# Altium schematic sheet Drive.SchDoc
size A3; PageSetup: Record=PageOptions|CenterHorizontal=True|CenterVertical=True|PrintScale=1.00|XCorrection=1.00|YCorrection=1.00|PrintKind=0|BorderSize=5000000|LeftOffset=0|BottomOffset=0|Orientation=2|PaperLength=1000|PaperWidth=1000|Scale=100|PaperSource=7|PrintQuality=-4|MediaType=1|DitherType=10|PaperKind=A3|PrintScaleMode=1
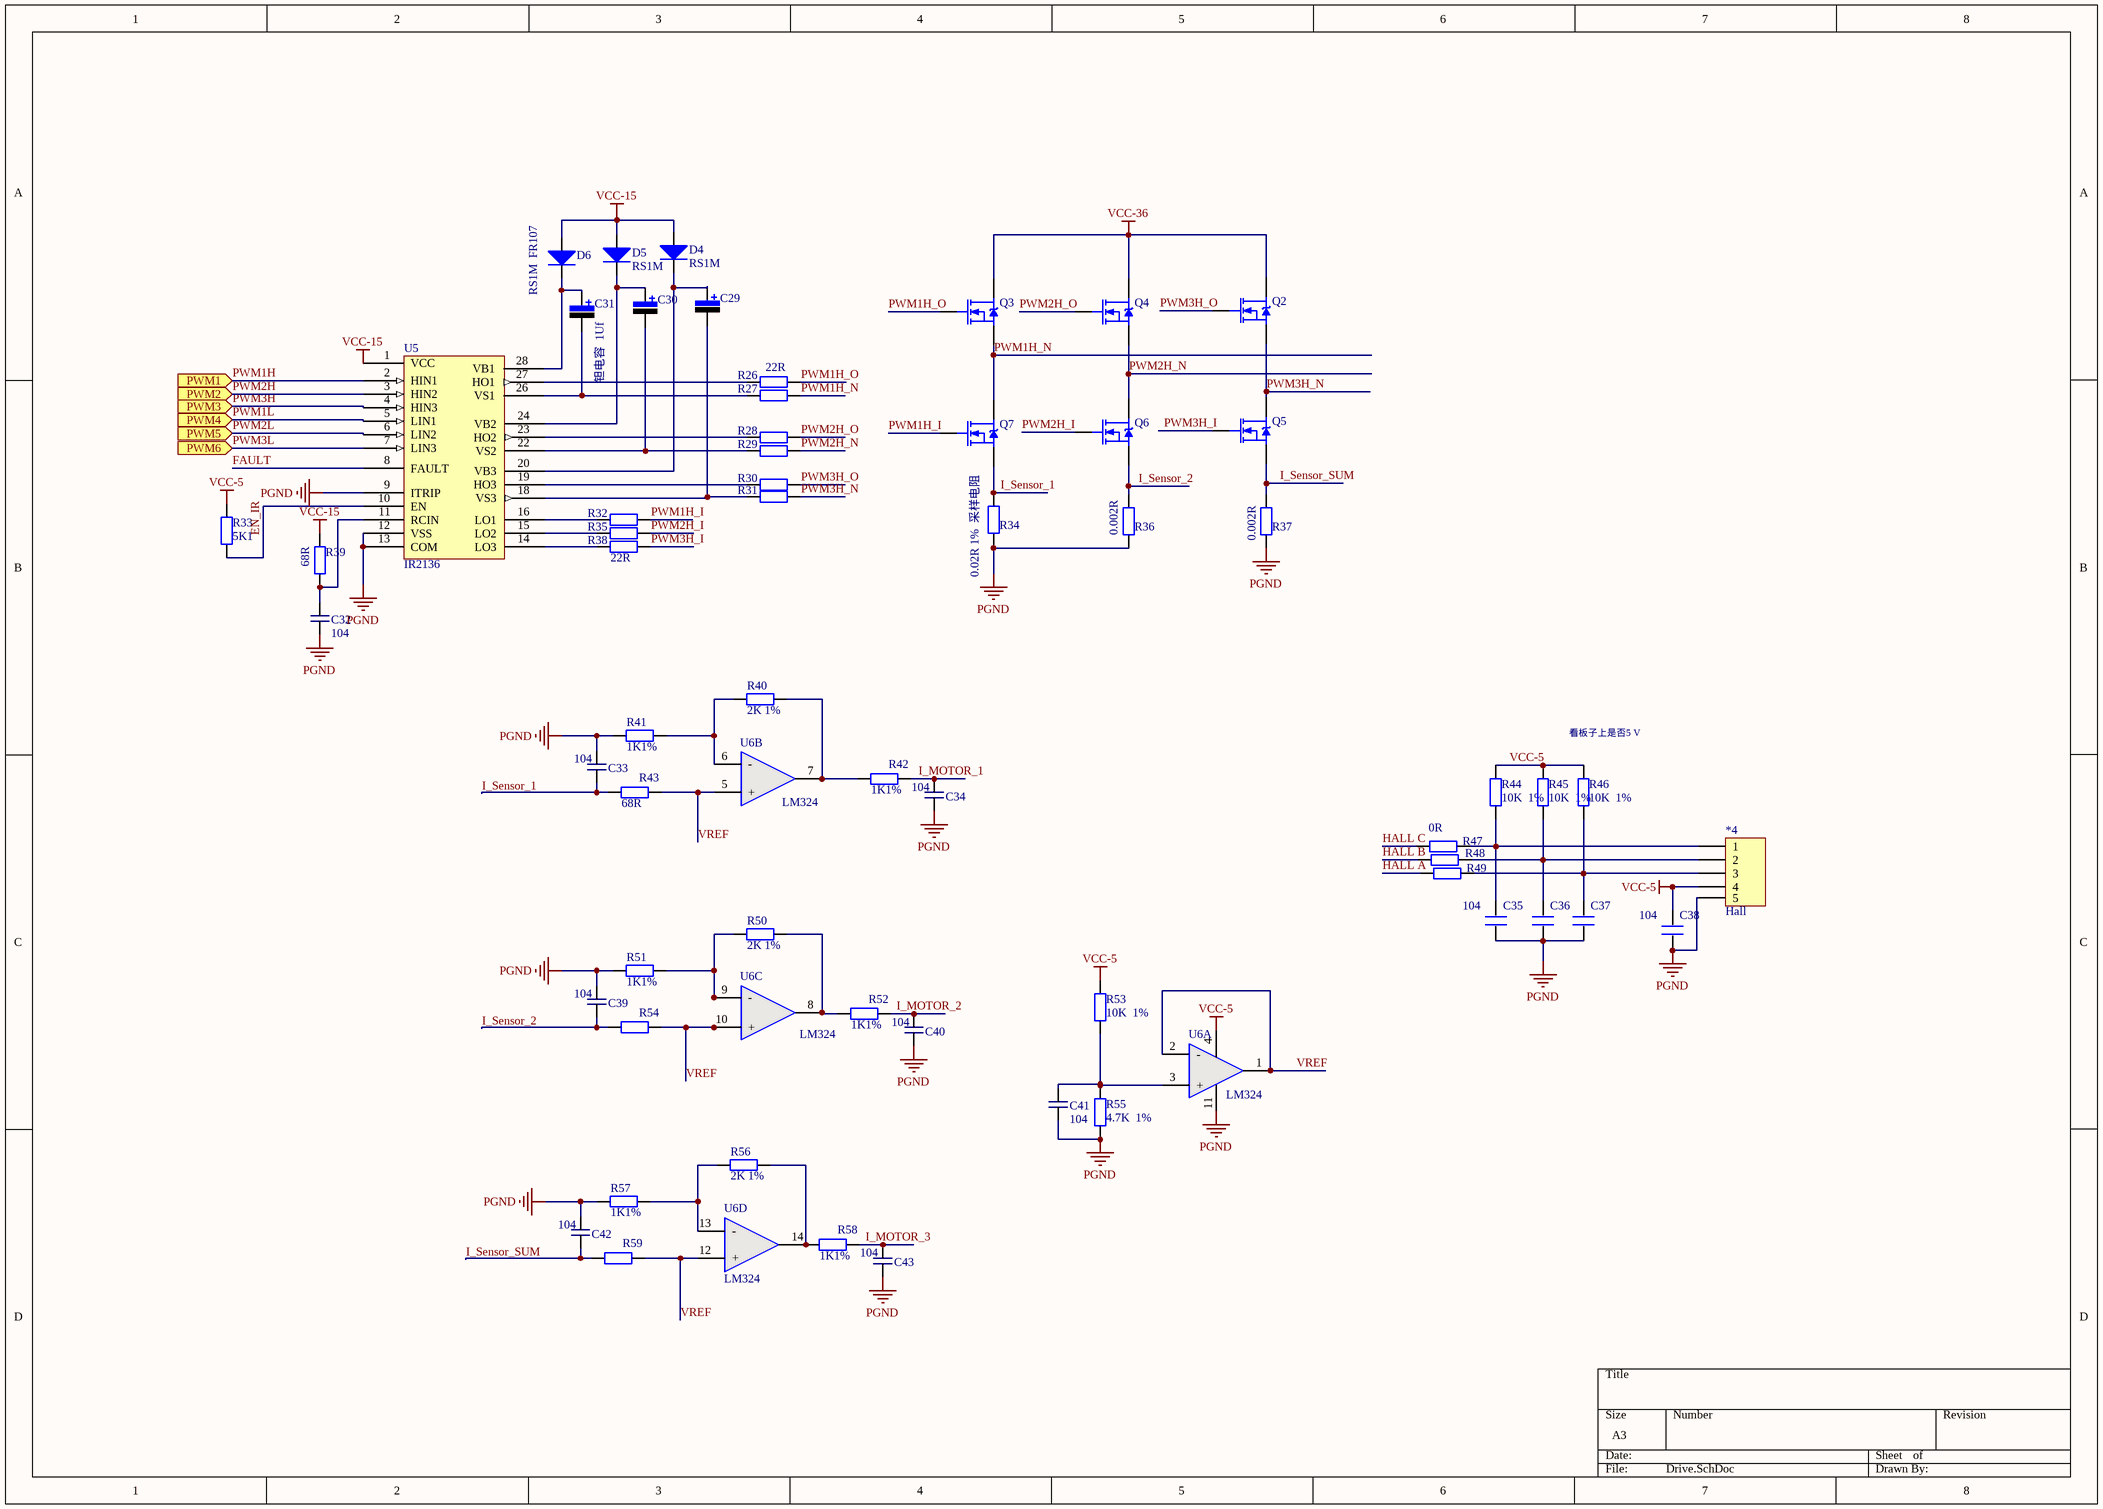
[diagram p0: Drive.SchDoc]

## Parts
*4  Hall  [普通五口接线柱]
C29  钽电容  [3216A  Ta]  (value not drawn)
C30  钽电容  [3216A  Ta]  (value not drawn)
C31  钽电容  1Uf  [3216A  Ta]
C32  104  [0603- C]
C33  104  [0603- C]
C34  104  [0603- C]
C35  104  [0603- C]
C36  104  [0603- C]  (value not drawn)
C37  104  [0603- C]  (value not drawn)
C38  104  [0603- C]
C39  104  [0603- C]
C40  104  [0603- C]
C41  104  [0603- C]
C42  104  [0603- C]
C43  104  [0603- C]
D4  RS1M  [D RS1M]
D5  RS1M  [D RS1M]
D6  RS1M  FR107  [D RS1M]
Q2  IRF540NS  [TO-220AB  MOS]  (value not drawn)
Q3  IRF540NS  [TO-220AB  MOS]  (value not drawn)
Q4  IRF540NS  [TO-220AB  MOS]  (value not drawn)
Q5  IRF540NS  [TO-220AB  MOS]  (value not drawn)
Q6  IRF540NS  [TO-220AB  MOS]  (value not drawn)
Q7  IRF540NS  [TO-220AB  MOS]  (value not drawn)
R26  22R  [0805R]
R27  68R  [0805R]  (value not drawn)
R28  68R  [0805R]  (value not drawn)
R29  68R  [0805R]  (value not drawn)
R30  68R  [0805R]  (value not drawn)
R31  68R  [0805R]  (value not drawn)
R32  68R  [0805R]  (value not drawn)
R33  5K1  [0603-R]
R34  0.02R 1%  采样电阻  [2512R]
R35  68R  [0805R]  (value not drawn)
R36  0.002R  [2512R]
R37  0.002R  [2512R]
R38  22R  [0805R]
R39  68R  [0603-R]
R40  2K 1%  [0603-R]
R41  1K1%  [0603-R]
R42  1K1%  [0603-R]
R43  68R  [0603-R]
R44  10K  1%  [0603-R]
R45  10K  1%  [0603-R]
R46  10K  1%  [0603-R]
R47  0R  [0603-R]
R48  R  [0603-R]  (value not drawn)
R49  R  [0603-R]  (value not drawn)
R50  2K 1%  [0603-R]
R51  1K1%  [0603-R]
R52  1K1%  [0603-R]
R53  10K  1%  [0603-R]
R54  1K1%  [0603-R]  (value not drawn)
R55  4.7K  1%  [0603-R]
R56  2K 1%  [0603-R]
R57  1K1%  [0603-R]
R58  1K1%  [0603-R]
R59  1K1%  [0603-R]  (value not drawn)
U5  IR2136  [IR2136S SOIC-28]
U6  LM324  [SOP-14N]  (parts A,B,C,D of 4)

## Ports
PWM1 (in), PWM2 (in), PWM3 (in), PWM4 (in), PWM5 (in), PWM6 (in)

## Nets
PGND: *4.5 C32.2 C33.1 C34.2 C35.1 C36.1 C37.1 C38.1 C39.1 C40.2 C41.2 C42.1 C43.2 R34.1 R36.1 R37.1 R41.2 R51.2 R55.2 R57.2 U5.9(ITRIP) U5.12(VSS) U5.13(COM) U6.11(V-)
VCC-5: *4.4 C38.2 R33.1 R44.1 R45.1 R46.1 R53.1 U6.4(V+)
VCC-15: D4.A D5.A D6.A R39.1 U5.1(VCC)
VCC-36: Q2.D Q3.D Q4.D
EN_IR: R33.2 U5.10(EN)
FAULT: U5.8(FAULT)
HALL A: R49.1
HALL B: R48.1
HALL C: R47.1
I_MOTOR_1: C34.1 R42.1
I_MOTOR_2: C40.1 R52.1
I_MOTOR_3: C43.1 R58.1
I_Sensor_1: C33.2 Q7.S R34.2 R43.2
I_Sensor_2: C39.2 Q6.S R36.2 R54.2
I_Sensor_SUM: C42.2 Q5.S R37.2 R59.2
PWM1H: U5.2(HIN1) ; port PWM1
PWM1H_I: Q7.G R32.2
PWM1H_N: Q3.S Q7.D R27.2
PWM1H_O: Q3.G R26.2
PWM1L: U5.5(LIN1) ; port PWM4
PWM2H: U5.3(HIN2) ; port PWM2
PWM2H_I: Q6.G R35.2
PWM2H_N: Q4.S Q6.D R29.2
PWM2H_O: Q4.G R28.2
PWM2L: U5.6(LIN2) ; port PWM5
PWM3H: U5.4(HIN3) ; port PWM3
PWM3H_I: Q5.G R38.2
PWM3H_N: Q2.S Q5.D R31.2
PWM3H_O: Q2.G R30.2
PWM3L: U5.7(LIN3) ; port PWM6
VREF: R43.1 R54.1 R59.1 U6.1(OUT) U6.2(-) U6.5(+) U6.10(+) U6.12(+)
Net*4_1: *4.1 C35.2 R44.2 R47.2
Net*4_2: *4.2 C36.2 R45.2 R48.2
Net*4_3: *4.3 C37.2 R46.2 R49.2
NetC29_1: C29.1 D4.K U5.20(VB3)
NetC29_2: C29.2 R31.1 U5.18(VS3)
NetC30_1: C30.1 D5.K U5.24(VB2)
NetC30_2: C30.2 R29.1 U5.22(VS2)
NetC31_1: C31.1 D6.K U5.28(VB1)
NetC31_2: C31.2 R27.1 U5.26(VS1)
NetC32_1: C32.1 R39.2 U5.11(RCIN)
NetC41_1: C41.1 R53.2 R55.1 U6.3(+)
NetR26_1: R26.1 U5.27(HO1)
NetR28_1: R28.1 U5.23(HO2)
NetR30_1: R30.1 U5.19(HO3)
NetR32_1: R32.1 U5.16(LO1)
NetR35_1: R35.1 U5.15(LO2)
NetR38_1: R38.1 U5.14(LO3)
NetR40_1: R40.1 R42.2 U6.7(OUT)
NetR40_2: R40.2 R41.1 U6.6(-)
NetR50_1: R50.1 R52.2 U6.8(OUT)
NetR50_2: R50.2 R51.1 U6.9(-)
NetR56_1: R56.1 R58.2 U6.14(OUT)
NetR56_2: R56.2 R57.1 U6.13(-)

## Notes on the sheet
- 看板子上是否5 V

## Library data of the parts
*4 = Head_5
C29 C30 = Cap_2
C31 = Cap_2: 钽电容
C32-C34 C39-C43 = Cap
C35-C38 = C
D4-D6 = D_1: 二极管
Q2-Q7 = IRF540NS: MOS
R26-R47 R50-R59 = R
U6 = LM324: 4运放SOP8芯片